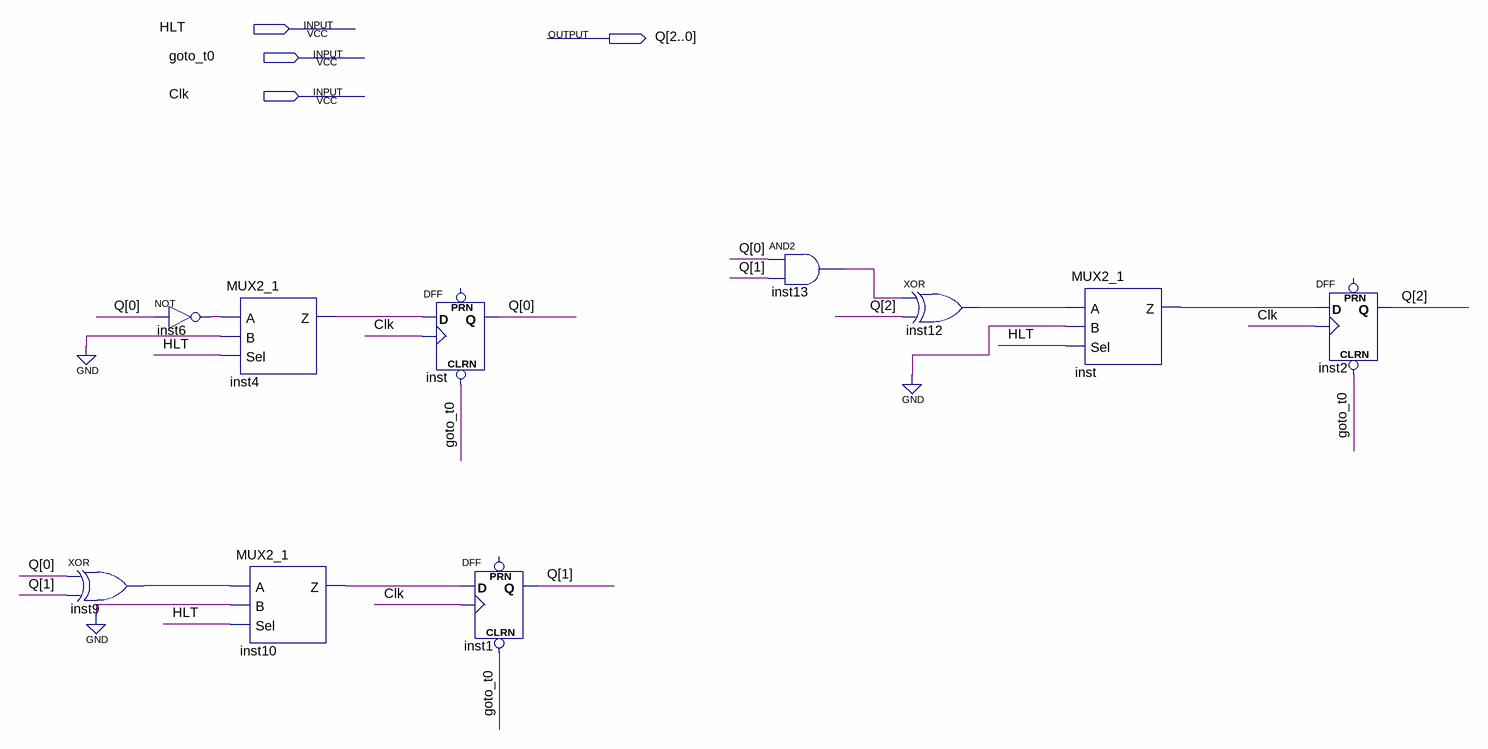
[diagram p0: schematic sheet]
// Quartus schematic SyncCounter3.bdf as structural Verilog: 10 symbols, 4 pins
module SyncCounter3 (
  input  HLT,
  input  goto_t0,
  input  Clk,
  output [2:0] Q
);

  wire inst4_z, inst6_out, inst9_out, inst10_z, inst12_out, inst13_out, inst_z;

  xor inst9 (inst9_out, Q[0], Q[1]);
  not inst6 (inst6_out, Q[0]);
  MUX2_1 inst4 (.A(inst6_out), .B(1'b0), .Sel(HLT), .Z(inst4_z));
  MUX2_1 inst10 (.A(inst9_out), .B(1'b0), .Sel(HLT), .Z(inst10_z));
  DFF inst (.CLRN(goto_t0), .CLK(Clk), .D(inst4_z), .Q(Q[0]));  // open: PRN
  DFF inst1 (.CLRN(goto_t0), .CLK(Clk), .D(inst10_z), .Q(Q[1]));  // open: PRN
  and inst13 (inst13_out, Q[0], Q[1]);
  xor inst12 (inst12_out, inst13_out, Q[2]);
  MUX2_1 inst_dup2 (.A(inst12_out), .B(1'b0), .Sel(HLT), .Z(inst_z));
  DFF inst2 (.CLRN(goto_t0), .CLK(Clk), .D(inst_z), .Q(Q[2]));  // open: PRN
endmodule
